# EAGLE design KineticMod (EAGLE 9.5.1)
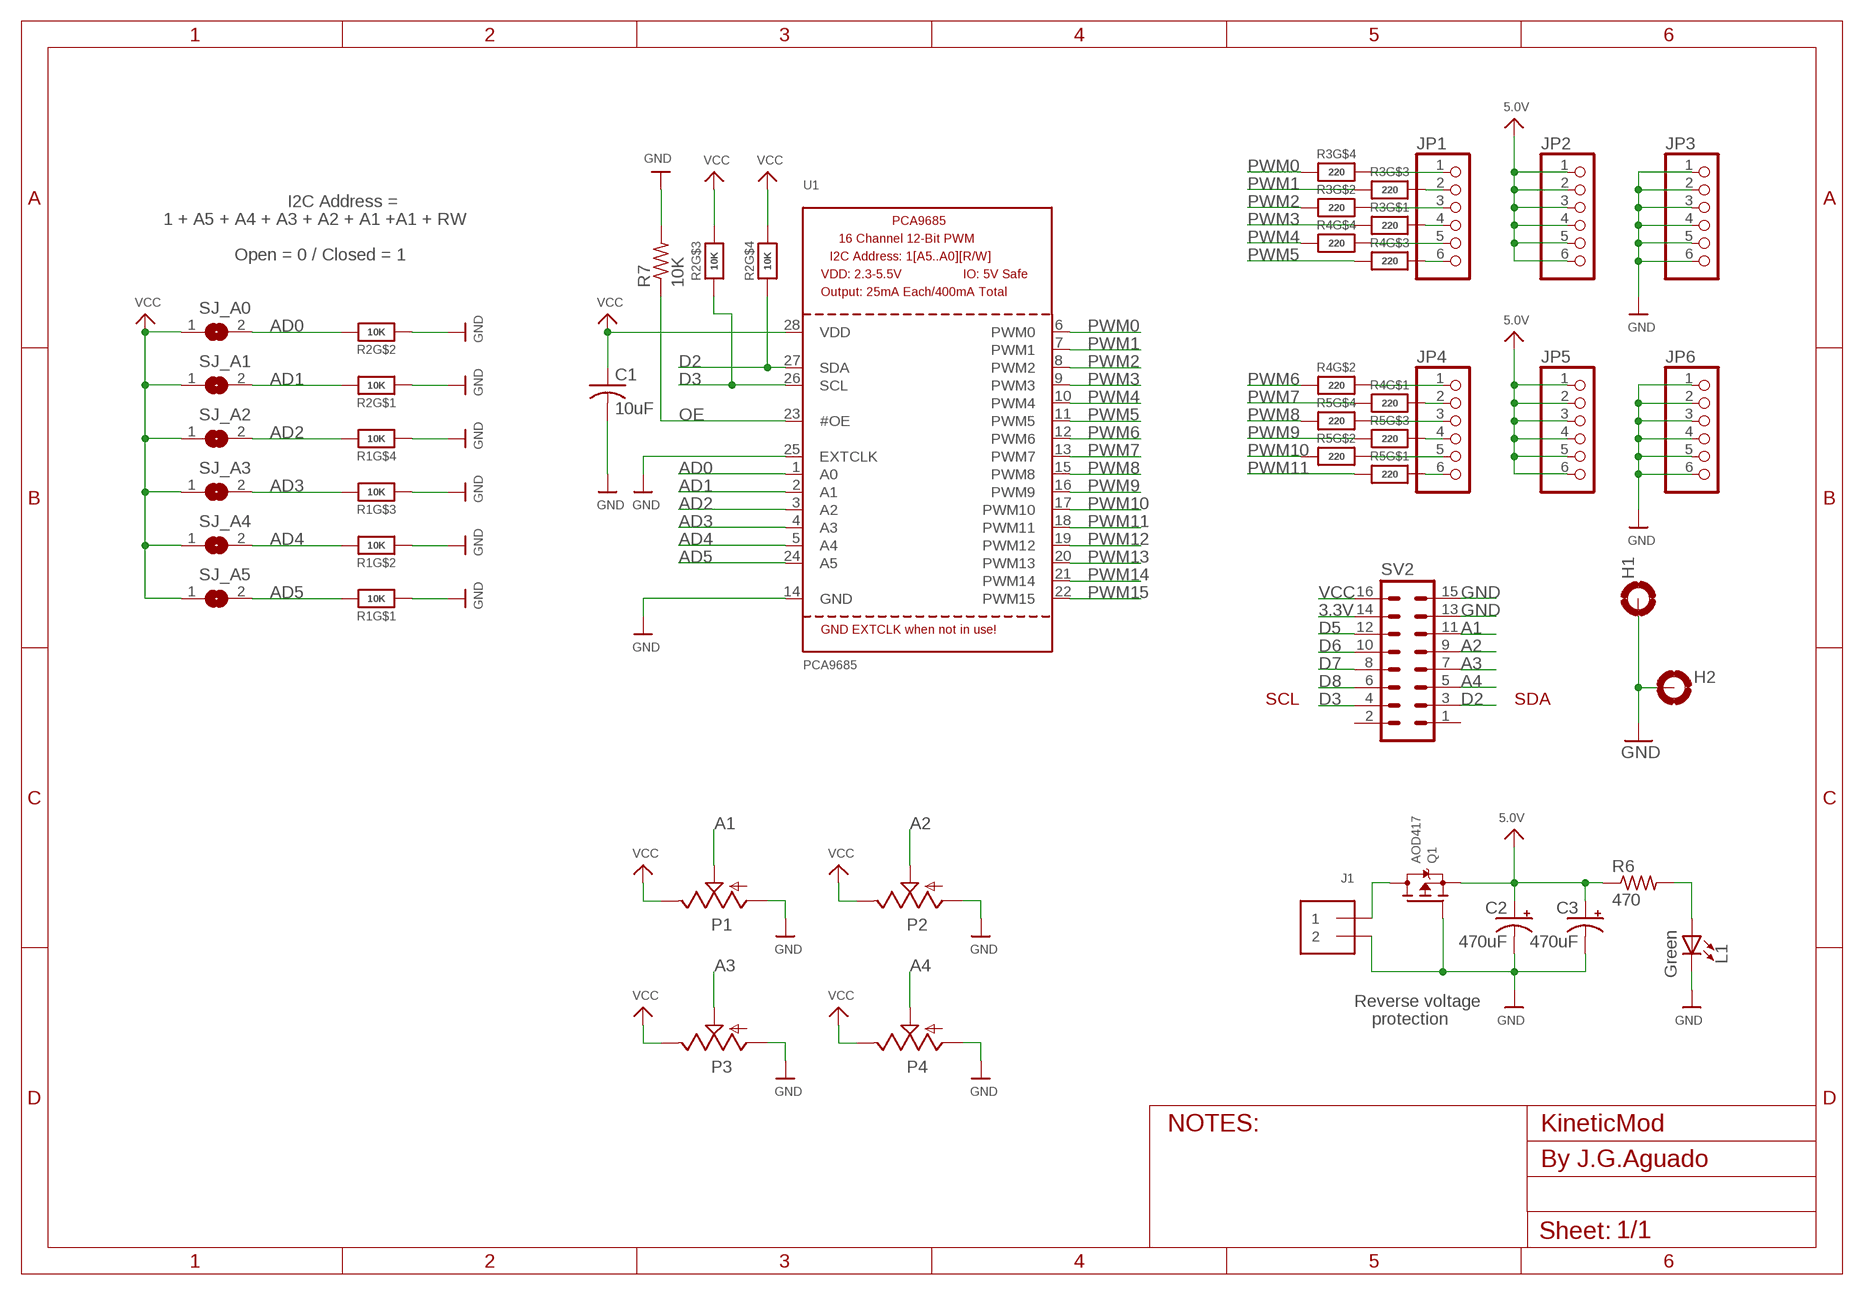
[diagram p0: schematic, sheet 1]

## Parts
C1  10uF  C1206  [1206]
C2  470uF  CPOL-USD/7343-31R  [D/7343-31R]
C3  470uF  CPOL-USD/7343-31R  [D/7343-31R]
H1  MOUNT-PAD-ROUND3.2  [3,2-PAD]
H2  MOUNT-PAD-ROUND3.2  [3,2-PAD]
J1  TERMBLOCK_1X2  [TERMBLOCK_1X2-3.5MM]
JP1  PINHD-1X6  [1X06]
JP2  PINHD-1X6  [1X06]
JP3  PINHD-1X6  [1X06]
JP4  PINHD-1X6  [1X06]
JP5  PINHD-1X6  [1X06]
JP6  PINHD-1X6  [1X06]
L1  Green  LED1206  [LED1206]
P1  ALPS_RK09K_VERTICAL  [ALPS_RK09K_VERTICAL]
P2  ALPS_RK09K_VERTICAL  [ALPS_RK09K_VERTICAL]
P3  ALPS_RK09K_VERTICAL  [ALPS_RK09K_VERTICAL]
P4  ALPS_RK09K_VERTICAL  [ALPS_RK09K_VERTICAL]
Q1  AOD417  MOSFET-PTO252  [TO252]
R1  10K  RESISTOR_4PACK  [RESPACK_4X0603]
R2  10K  RESISTOR_4PACK  [RESPACK_4X0603]
R3  220  RESISTOR_4PACK  [RESPACK_4X0603]
R4  220  RESISTOR_4PACK  [RESPACK_4X0603]
R5  220  RESISTOR_4PACK  [RESPACK_4X0603]
R6  470  R1206  [1206]
R7  10K  R1206  [1206]
SJ_A0  SOLDERJUMPERREFLOW_NOPASTE  [SOLDERJUMPER_REFLOW_NOPASTE]
SJ_A1  SOLDERJUMPERREFLOW_NOPASTE  [SOLDERJUMPER_REFLOW_NOPASTE]
SJ_A2  SOLDERJUMPERREFLOW_NOPASTE  [SOLDERJUMPER_REFLOW_NOPASTE]
SJ_A3  SOLDERJUMPERREFLOW_NOPASTE  [SOLDERJUMPER_REFLOW_NOPASTE]
SJ_A4  SOLDERJUMPERREFLOW_NOPASTE  [SOLDERJUMPER_REFLOW_NOPASTE]
SJ_A5  SOLDERJUMPERREFLOW_NOPASTE  [SOLDERJUMPER_REFLOW_NOPASTE]
SV2  MA08-2  [MA08-2]
U1  PCA9685  [TSSOP28]

## Nets
3.3V: SV2.14
5.0V: C2.+ C3.+ JP2.1 JP2.2 JP2.3 JP2.4 JP2.5 JP2.6 JP5.1 JP5.2 JP5.3 JP5.4 JP5.5 JP5.6 Q1.2(S) R6.1
A1: P1.2 SV2.11
A2: P2.2 SV2.9
A3: P3.2 SV2.7
A4: P4.2 SV2.5
AD0: R2.7 SJ_A0.2 U1.1(A0)
AD1: R2.8 SJ_A1.2 U1.2(A1)
AD2: R1.5 SJ_A2.2 U1.3(A2)
AD3: R1.6 SJ_A3.2 U1.4(A3)
AD4: R1.7 SJ_A4.2 U1.5(A4)
AD5: R1.8 SJ_A5.2 U1.24(A5)
D2: R2.4 SV2.3 U1.27(SDA)
D3: R2.3 SV2.4 U1.26(SCL)
D5: SV2.12
D6: SV2.10
D7: SV2.8
D8: SV2.6
GND: C1.2 C2.- C3.- H1.B3,2(MOUNT) H2.B3,2(MOUNT) J1.2 JP3.1 JP3.2 JP3.3 JP3.4 JP3.5 JP3.6 JP6.1 JP6.2 JP6.3 JP6.4 JP6.5 JP6.6 L1.C P1.1 P2.1 P3.1 P4.1 Q1.1(G) R1.1 R1.2 R1.3 R1.4 R2.1 R2.2 R7.2 SV2.13 SV2.15 U1.14(GND) U1.25(EXTCLK)
N$1: L1.A R6.2
N$2: JP4.1 R4.7
N$3: JP4.2 R4.8
N$4: JP1.6 R4.6
N$5: JP1.5 R4.5
N$6: JP1.4 R3.8
N$7: JP1.3 R3.7
N$8: JP1.2 R3.6
N$9: JP1.1 R3.5
N$10: JP4.3 R5.5
N$11: JP4.4 R5.6
N$12: JP4.5 R5.7
N$13: JP4.6 R5.8
OE: R7.1 U1.23(#OE)
PWM0: R3.4 U1.6(PWM0)
PWM1: R3.3 U1.7(PWM1)
PWM2: R3.2 U1.8(PWM2)
PWM3: R3.1 U1.9(PWM3)
PWM4: R4.4 U1.10(PWM4)
PWM5: R4.3 U1.11(PWM5)
PWM6: R4.2 U1.12(PWM6)
PWM7: R4.1 U1.13(PWM7)
PWM8: R5.4 U1.15(PWM8)
PWM9: R5.3 U1.16(PWM9)
PWM10: R5.2 U1.17(PWM10)
PWM11: R5.1 U1.18(PWM11)
PWM12: U1.19(PWM12)
PWM13: U1.20(PWM13)
PWM14: U1.21(PWM14)
PWM15: U1.22(PWM15)
PWRIN: J1.1 Q1.3(D)
VCC: C1.1 P1.3 P2.3 P3.3 P4.3 R2.5 R2.6 SJ_A0.1 SJ_A1.1 SJ_A2.1 SJ_A3.1 SJ_A4.1 SJ_A5.1 SV2.16 U1.28(VDD)
Unconnected: SV2.1 SV2.2

## Notes on the sheet
- I2C Address =
- 1 + A5 + A4 + A3 + A2 + A1 +A1 + RW
- Open = 0 / Closed = 1
- Humidity
- SCL | SDA
- Pressure
- Reverse voltage
- protection

## Library data of the parts
C1 = SpaceDIY_passive_components:C1206
C2 C3 = rcl:CPOL-US: POLARIZED CAPACITOR, American symbol; SPICEPREFIX: C
H1 H2 = holes:MOUNT-PAD-ROUND: MOUNTING PAD, round
J1 = microbuilder:TERMBLOCK_1X2: 3.5mm Terminal block http://www.ladyada.net/library/pcb/eaglelibrary.html
JP1-JP6 = pinhead:PINHD-1X6: PIN HEADER
L1 = SpaceDIY_passive_components:LED1206
P1-P4 = audio-pots:ALPS_RK09K_VERTICAL
Q1 = microbuilder:MOSFET-P: P-Channel Mosfet LEGEND VDS: Voltage Drain-Source ID: Drain Current RDS(ON): Drain-Source On-State Resistance VGS(TH): Gate-Source Threshold Voltage CISS: Drain-Source Input Capacitance SOT-23 Name VDS ID RDS(ON) VGS(TH) CISS Order Number IRLML5103 30V 760mA 600 mOhm -- 75pF @ 25V Digikey: IRLML5103PBFCT-ND IRLML6401 12V 4.3A 50 mOhm 950mV @ 250µA 830pF @ 10V Digikey: IRLML6401PBFTR-ND NTR0202PL 20V 400mA 800 mOhm 2.3V @ 250uA 70pF @ 5V Digikey: NTR0202PLT1GOSTR-ND NTR4101PT1G 20V 1.8A 85 mOhm 1.2V @ 250uA 675pF @ 10V Digikey: NTR4101PT1GOSCT-ND DMP2004K 20V 600mA 900 mOhm 1V @ 250uA 175pF @ 16V Digikey: DMP2004KDICT-ND PMV65XP 20V 3.9A 76 mOhm 950mV @ 1mA 725pF @ 20V Digikey: 568-2358-2-ND TO-252 Name VDS ID RDS(ON) VGS(TH) CISS Order Number AOD417 30V 25A 34 mOhm 3V @ 250µA 920pF @ 15V Digikey: 785-1106-2-ND
R1-R5 = microbuilder:RESISTOR_4PACK: Resistor Packs (4 resistors) 4 x 0603 10K 1/16W - Digikey: YC164J-10KCT-ND
R6 R7 = SpaceDIY_passive_components:R1206
SJ_A0 SJ_A1-SJ_A5 = microbuilder:SOLDERJUMPER: SMD Solder JUMPER Solder the two pads together to create a connection, or remove the solder to break it. REFLOW - Use this footprint for solder paste and reflow ovens. WAVE - Use this footprint for hand-soldering (larger pads). CLOSED - Has a trace between the two pads to ensure it is closed by default. The trace needs to be cut to disable the jumper, and can be closed again by creating a solder bridge between the two pads.
SV2 = con-lstb:MA08-2: PIN HEADER; OC_FARNELL: unknown; OC_NEWARK: unknown
U1 = microbuilder:PCA9685: PCA9685 - 16 Channel 12-Bit I2C PWM Controller 5.0V tolerant 16 channel, 12-bit I2C PWM controller with 25mA per output (max. 400mA total) Digikey: 568-5931-1-ND

## Net classes
1 vcc: width 0.254 mm

## Board
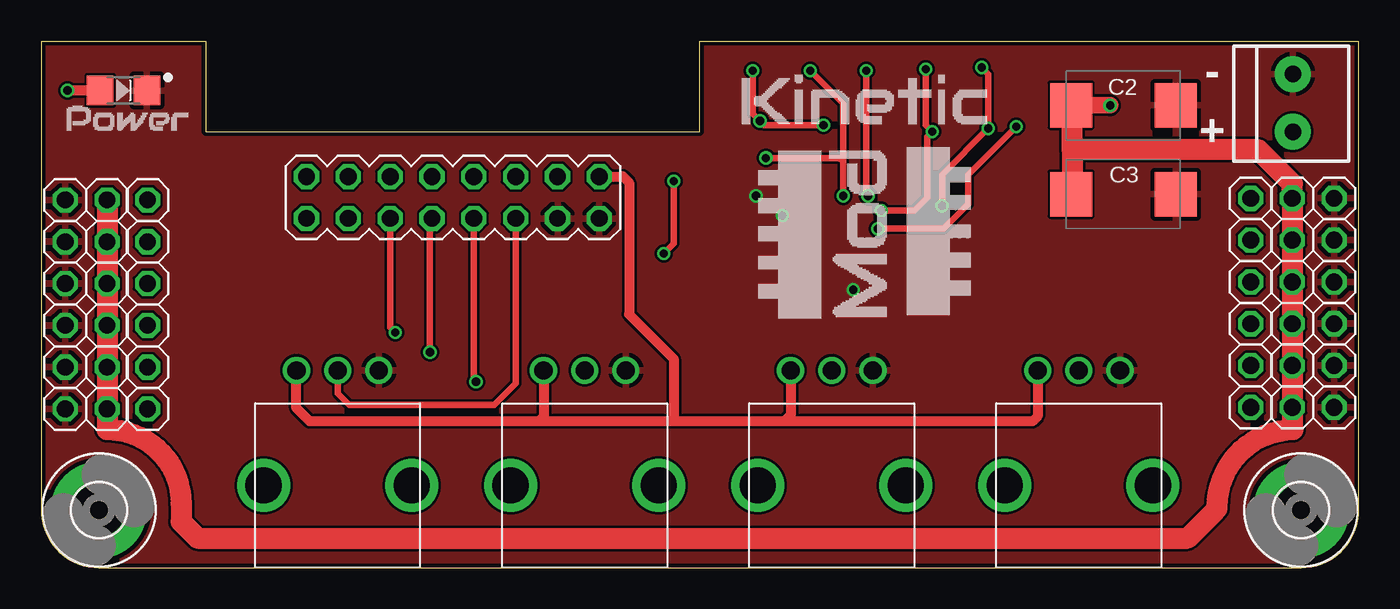
[diagram p1: board, top side]
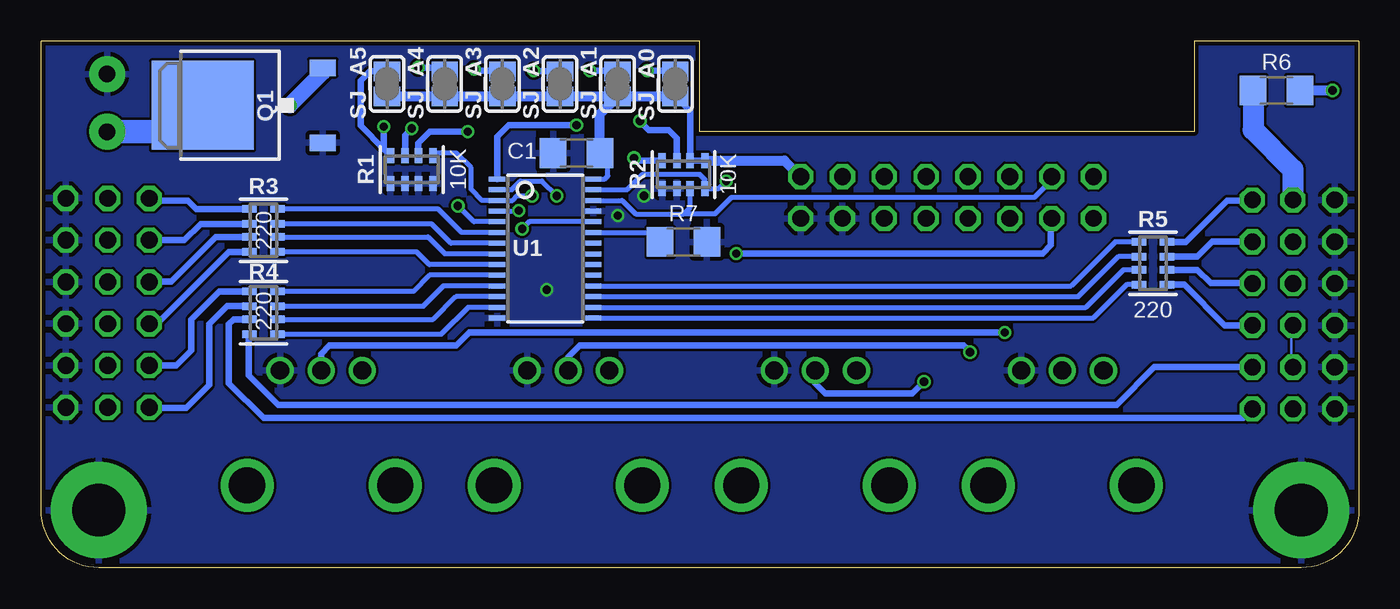
[diagram p2: board, bottom side, seen from below]

Size 80 x 32 mm. Coordinates in mm from the lower left corner, seen from the top.
Outline: 0,32 0,3.5 arc90 3.5,0 76.5,0 arc90 80,3.5 80,32 40,32 40,26.5 10,26.5 10,32 0,32
Copper layers (1*16): Top 0.035mm / dielectric 1.5mm / Bottom 0.035mm
Design rules "SeeedStudio_2layer_DRU_no_angle_20140221": minimum track width 6mil, minimum drill 12mil, track to track 6mil, track to pad 6mil, pad to pad 6mil, via to via 6mil, smd to smd 0mil, copper to edge 10mil, drill to drill 10mil, minimum pad ring 10mil, minimum via ring 6mil, stop-mask expansion 2mil, vias tented up to drill 100mil, thermal gap 10mil

### Footprints (pad centres in the part's own frame; a part is rotated, then mirrored left to right if it is on the bottom)
1206 = smd 1.6 x 1.803: 1 -1.422,0; 2 1.422,0
D/7343-31R = smd 2.55 x 2.7: + 3.175,0; - -3.175,0
3,2-PAD = drill 3.2 pad 5.842: B3,2 0,0
TERMBLOCK_1X2-3.5MM = drill 1 pad 2.184: 1 1.8,0; 2 -1.7,0
1X06 = drill 1.016 octagon: 1 -6.35,0; 2 -3.81,0; 3 -1.27,0; 4 1.27,0; 5 3.81,0; 6 6.35,0
LED1206 = smd 1.6 x 1.803: A -1.422,0; C 1.422,0
ALPS_RK09K_VERTICAL = drill 1.1: 1 -2.5,-7; 2 0,-7; 3 2.5,-7 | drill 2.2: P$1 -4.5,0; P$2 4.5,0
TO252 = smd 1 x 1.6: 1 -2.28,-4.8; 2 2.28,-4.8 | smd 5.4 x 6.2: 3 0,2.5
RESPACK_4X0603 = smd 0.45 x 0.9: 1 -1.3,-0.85; 2 -0.4,-0.85; 3 0.4,-0.85; 4 1.3,-0.85; 5 1.3,0.85; 6 0.4,0.85; 7 -0.4,0.85; 8 -1.3,0.85
SOLDERJUMPER_REFLOW_NOPASTE = smd 1.168 x 1.6: 1 -0.762,0; 2 0.762,0
MA08-2 = drill 1.016 octagon: 1 -8.89,-1.27; 2 -8.89,1.27; 3 -6.35,-1.27; 4 -6.35,1.27; 5 -3.81,-1.27; 6 -3.81,1.27; 7 -1.27,-1.27; 8 -1.27,1.27; 9 1.27,-1.27; 10 1.27,1.27; 11 3.81,-1.27; 12 3.81,1.27; 13 6.35,-1.27; 14 6.35,1.27; 15 8.89,-1.27; 16 8.89,1.27
TSSOP28 = smd 0.305 x 0.991: 1 -4.225,-2.918; 2 -3.575,-2.918; 3 -2.925,-2.918; 4 -2.275,-2.918; 5 -1.625,-2.918; 6 -0.975,-2.918; 7 -0.325,-2.918; 8 0.325,-2.918; 9 0.975,-2.918; 10 1.625,-2.918; 11 2.275,-2.918; 12 2.925,-2.918; 13 3.575,-2.918; 14 4.225,-2.918; 15 4.225,2.918; 16 3.575,2.918; 17 2.925,2.918; 18 2.275,2.918; 19 1.625,2.918; 20 0.975,2.918; 21 0.325,2.918; 22 -0.325,2.918; 23 -0.975,2.918; 24 -1.625,2.918; 25 -2.275,2.918; 26 -2.925,2.918; 27 -3.575,2.918; 28 -4.225,2.918

### Placement (x,y rotation side)
C1  47.5,25.2 180 bottom
C2  65.7,28.1 180 top
C3  65.7,22.7 180 top
H1  3.5,3.5 0 top
H2  76.5,3.5 0 top
J1  76,28.3 270 top
JP1  73.44,16.1 270 top
JP2  75.96,16.1 90 top
JP3  78.5,16.1 90 top
JP4  6.46,16 90 top
JP5  4,16 270 top
JP6  1.46,16 270 top
L1  5,29 0 top
P1  18,5 180 top
P2  33,5 180 top
P3  48,5 180 top
P4  63,5 180 top
Q1  67.7,28.1 90 bottom
R1  57.5,24.2 0 bottom
R2  41,23.9 0 bottom
R3  66.5,20.5 90 bottom
R4  66.5,15.5 90 bottom
R5  12.5,18.5 270 bottom
R6  5,29 0 bottom
R7  41,19.8 0 bottom
SJ_A0  41.5,29.4 90 bottom
SJ_A1  45,29.4 90 bottom
SJ_A2  48.5,29.4 90 bottom
SJ_A3  52,29.4 90 bottom
SJ_A4  55.5,29.4 90 bottom
SJ_A5  59,29.4 90 bottom
SV2  25,22.5 0 top
U1  49.4,19.4 270 bottom

### Tracks (layer width: path | path; a pad name or v marks a point on that pad's centre or on a via)
5.0V  (via drill 0.5)
  Top 0.152: JP5.5 4.12,12.19 JP5.5 | JP5.3 4.12,17.37 4,17.37 | JP5.2 4.12,19.81 JP5.2 | JP2.2 76.05,12.34 75.96,12.34 | JP2.3 76.05,14.94 75.96,14.94 | JP2.4 76.05,17.37 JP2.4 | JP2.5 76.05,19.96 75.96,19.96
  Top 1.016: v64.9,28.1 C2.+
  Top 1.27: 62.6,25.4 73.9,25.4 75.96,23.34 JP2.6 75.96,19.96 JP2.5 JP2.4 75.96,14.94 JP2.3 75.96,12.34 JP2.2 JP2.1 arc-90 76,9.71 76,8.4 arc90 71.4,3.6 arc90 71.3,3.5 69.6,1.8 9.5,1.8 8.5,2.8 8.5,3.9 arc90 4,8.4 JP5.6 JP5.5 JP5.3 4,17.37 JP5.2 JP5.1 | 62.6,25.4 62.6,28.03 C2.+ | 62.6,25.4 62.6,23.5 63.1,23 62.8,22.7 C3.+
  Bottom 0.152: JP5.5 4.12,12.19 4.12,14.63 JP5.4
  Bottom 1.016: v64.9,28.1 62.9,30.1 Q1.2
  Bottom 1.27: R6.1 6.42,26.62 4,24.2 JP5.1
A1
  Top 0.406: SV2.11 28.81,11.21 27.5,9.9 18.7,9.9 18,10.6 P1.2
A2  (via drill 0.5)
  Top 0.406: SV2.9 26.27,11.43 v26.4,11.3
  Bottom 0.406: v26.4,11.3 27.1,10.6 32.4,10.6 33,11.2 P2.2
A3  (via drill 0.5)
  Top 0.406: v23.6,13.1 23.6,21.1 SV2.7
  Bottom 0.406: P3.2 48,12.8 47.3,13.5 24,13.5 v23.6,13.1
A4  (via drill 0.5)
  Top 0.406: SV2.5 21.19,14.61 v21.5,14.3
  Bottom 0.406: 22,14.3 v21.5,14.3 54,14.3 54.8,13.5 62.5,13.5 63,13 P4.2
AD0  (via drill 0.5)
  Top 0.406: v47.5,26.9 44,26.9 | 44,26.9 43.9,26.9 v43.65,27.15 | v43.65,27.15 43.2,27.6 v43.2,30.2 | v43.65,27.15 43.75,27.15 44,26.9
  Bottom 0.254: SJ_A0.2 41.54,30.2
  Bottom 0.406: U1.1 52.32,26.18 51.6,26.9 v47.5,26.9 | 41.54,30.2 v43.2,30.2 | v43.65,27.15 43.1,26.6 41.9,26.6 41.4,26.1 R2.7
AD1  (via drill 0.5)
  Top 0.406: v48.7,22.6 48.7,24.7 | 48.7,24.7 48.7,28.2 v46.7,30.2 | v44,24.9 48.5,24.9 48.7,24.7
  Bottom 0.254: SJ_A1.2 45.04,30.2 45.4,30.2
  Bottom 0.305: U1.2 51.42,22.98 50.9,23.5 49.6,23.5 v48.7,22.6
  Bottom 0.406: 45.4,30.2 v46.7,30.2 | v44,24.9 43.85,24.75 R2.8
AD2  (via drill 0.5)
  Top 0.406: v50.1,30.2 50.1,22.7 v50.2,22.6
  Bottom 0.254: 56.05,25.2 R1.5
  Bottom 0.305: 56.05,25.2 54.8,25.2 53.9,24.3 53.9,23 53.23,22.32 U1.3 51.38,22.32 51.1,22.6 v50.2,22.6
  Bottom 0.406: v50.1,30.2 50.06,30.16 SJ_A2.2
AD3  (via drill 0.5)
  Top 0.406: v51,21.7 53,21.7 53.8,22.5 53.8,26.2 v54.1,26.5 53.7,26.9 v53.7,30.3
  Bottom 0.254: SJ_A3.2 52.04,30.2
  Bottom 0.305: U1.4 51.02,21.68 v51,21.7
  Bottom 0.406: v54.1,26.5 56.4,26.5 57.1,25.8 R1.6 | 52.04,30.2 53.6,30.2 v53.7,30.3
AD4  (via drill 0.5)
  Top 0.406: v54.7,22 54.7,23.9 v57.5,26.7 57.5,30 v57.1,30.4
  Bottom 0.254: 55.54,30.2 SJ_A4.2 55.74,30.4
  Bottom 0.305: U1.5 53.73,21.02 v54.7,22
  Bottom 0.406: v57.5,26.7 57.9,26.3 R1.7 | 55.74,30.4 v57.1,30.4
AD5  (via drill 0.5)
  Top 0.406: v50.8,20.6 54.8,20.6 56.3,22.1 56.3,23.9 v59.2,26.8
  Bottom 0.305: U1.24 50.38,21.02 v50.8,20.6
  Bottom 0.406: SJ_A5.2 60.04,30.16 60.6,29.6 60.6,26.85 59.2,25.45 | 59.2,25.45 R1.8 | v59.2,26.8 59.2,25.45
D2  (via drill 0.5)
  Top 0.406: v38.4,23.5 38.4,19.7 v37.8,19.1
  Bottom 0.305: U1.27 44.42,22.98 43.5,23.9 40,23.9 39.7,23.6 R2.4 38.85,23.05 v38.4,23.5
  Bottom 0.406: v37.8,19.1 19.2,19.1 18.7,19.6 18.7,21.18 SV2.3
D3
  Bottom 0.305: U1.26 44.73,22.32 43.9,21.5 41,21.5 | 41,21.5 40.6,21.9 R2.3 | SV2.4 18.65,23.55 19.7,22.5 38.1,22.5 39.1,21.5 41,21.5
GND  (via drill 0.5)
  other vias: 49.3,16.9 45,21.4 43.4,22.6
  pour Top: 80,32 80,3.5 arc-90 76.5,0 3.5,0 arc-90 0,3.5 0,32 10,32 10,26.5 40,26.5 40,32
  pour Bottom: 80,32 80,3.5 arc-90 76.5,0 3.5,0 arc-90 0,3.5 0,32 10,32 10,26.5 40,26.5 40,32
N$1  (via drill 0.5)
  Top 0.61: L1.A v1.6,29
  Bottom 0.61: v1.6,29 L1.A
N$2
  Bottom 0.406: R4.7 68.3,15.1 68.6,14.8 68.6,11.2 66.5,9.1 7.01,9.1 JP4.1
N$3
  Bottom 0.406: JP4.2 12.41,12.19 14.7,9.9 65.6,9.9 67.4,11.7 67.4,14.15 R4.8
N$4
  Bottom 0.406: R4.6 68.7,15.9 69.8,14.8 69.8,11.1 71.2,9.7 73.39,9.7 JP1.6
N$5
  Bottom 0.406: R4.5 69.2,16.8 70.9,15.1 70.9,13.2 71.8,12.3 JP1.5
N$6
  Bottom 0.406: R3.8 68.6,19.2 72.8,15 73.27,15 JP1.4
N$7
  Bottom 0.406: R3.7 69.4,20.1 72.1,17.4 73.41,17.4 JP1.3
N$8
  Bottom 0.406: R3.6 70.3,20.9 71.3,19.9 JP1.2
N$9
  Bottom 0.406: R3.5 70.6,21.8 71.1,22.3 73.29,22.3 JP1.1
N$10
  Bottom 0.406: JP4.3 8.13,14.73 10.6,17.2 R5.5
N$11
  Bottom 0.406: R5.6 9.8,18.1 9,17.3 6.49,17.3 JP4.4
N$12
  Bottom 0.406: JP4.5 8.89,19.81 9.8,18.9 R5.7
N$13
  Bottom 0.406: R5.8 10.5,19.8 8,22.3 6.51,22.3 JP4.6
OE
  Bottom 0.305: U1.23 43,20.38 R7.1
PWM0
  Bottom 0.305: U1.6 54.48,20.38 55.9,21.8 R3.4
PWM1
  Bottom 0.305: U1.7 55.12,19.73 56.3,20.9 R3.3
PWM2
  Bottom 0.305: R3.2 56.5,20.1 55.48,19.07 U1.8
PWM3
  Bottom 0.305: U1.9 56.42,18.43 57.2,19.2 R3.1
PWM4
  Bottom 0.305: U1.10 56.42,17.77 57.4,16.8 R4.4
PWM5
  Bottom 0.305: U1.11 55.58,17.12 56.8,15.9 R4.3
PWM6
  Bottom 0.305: R4.2 56.2,15.1 54.83,16.48 U1.12
PWM7
  Bottom 0.305: U1.13 54.08,15.82 55.7,14.2 R4.1
PWM8
  Bottom 0.305: R5.4 14.1,17.2 16.12,15.18 U1.15
PWM9
  Bottom 0.305: R5.3 14.3,18.1 16.57,15.82 U1.16
PWM10
  Bottom 0.305: R5.2 14.6,18.9 17.02,16.48 U1.17
PWM11
  Bottom 0.305: R5.1 14.8,19.8 17.48,17.12 U1.18
PWRIN
  Bottom 1.422: J1.1 71.8,26.5 Q1.3
VCC
  Top 0.61: SV2.16 35.33,23.77 35.7,23.4 35.7,15.4 38.4,12.7 38.4,8.9 | 38.4,8.9 30.2,8.9 | 30.2,8.9 16.3,8.9 15.5,9.7 P1.3 | P2.3 30.5,9.2 30.2,8.9 | P3.3 45.5,9.3 45.1,8.9 | 45.1,8.9 38.4,8.9 | P4.3 60.5,9.2 60.2,8.9 45.1,8.9
  Bottom 0.305: U1.28 45.77,23.62 45.6,23.8 45.6,24.72 C1.1
  Bottom 0.406: SJ_A0.1 40.6,27.74 R2.6 R2.5
  Bottom 0.61: C1.1 46.08,27.56 SJ_A1.1 | SJ_A0.1 SJ_A1.1 | SJ_A1.1 SJ_A2.1 SJ_A3.1 SJ_A4.1 SJ_A5.1 | R2.5 34.87,24.75 SV2.16

### Text on the board
tNames: - | +
tTest: - | + | + | -